# Altium schematic sheet FPGA SYSTERM.SchDoc
size A3
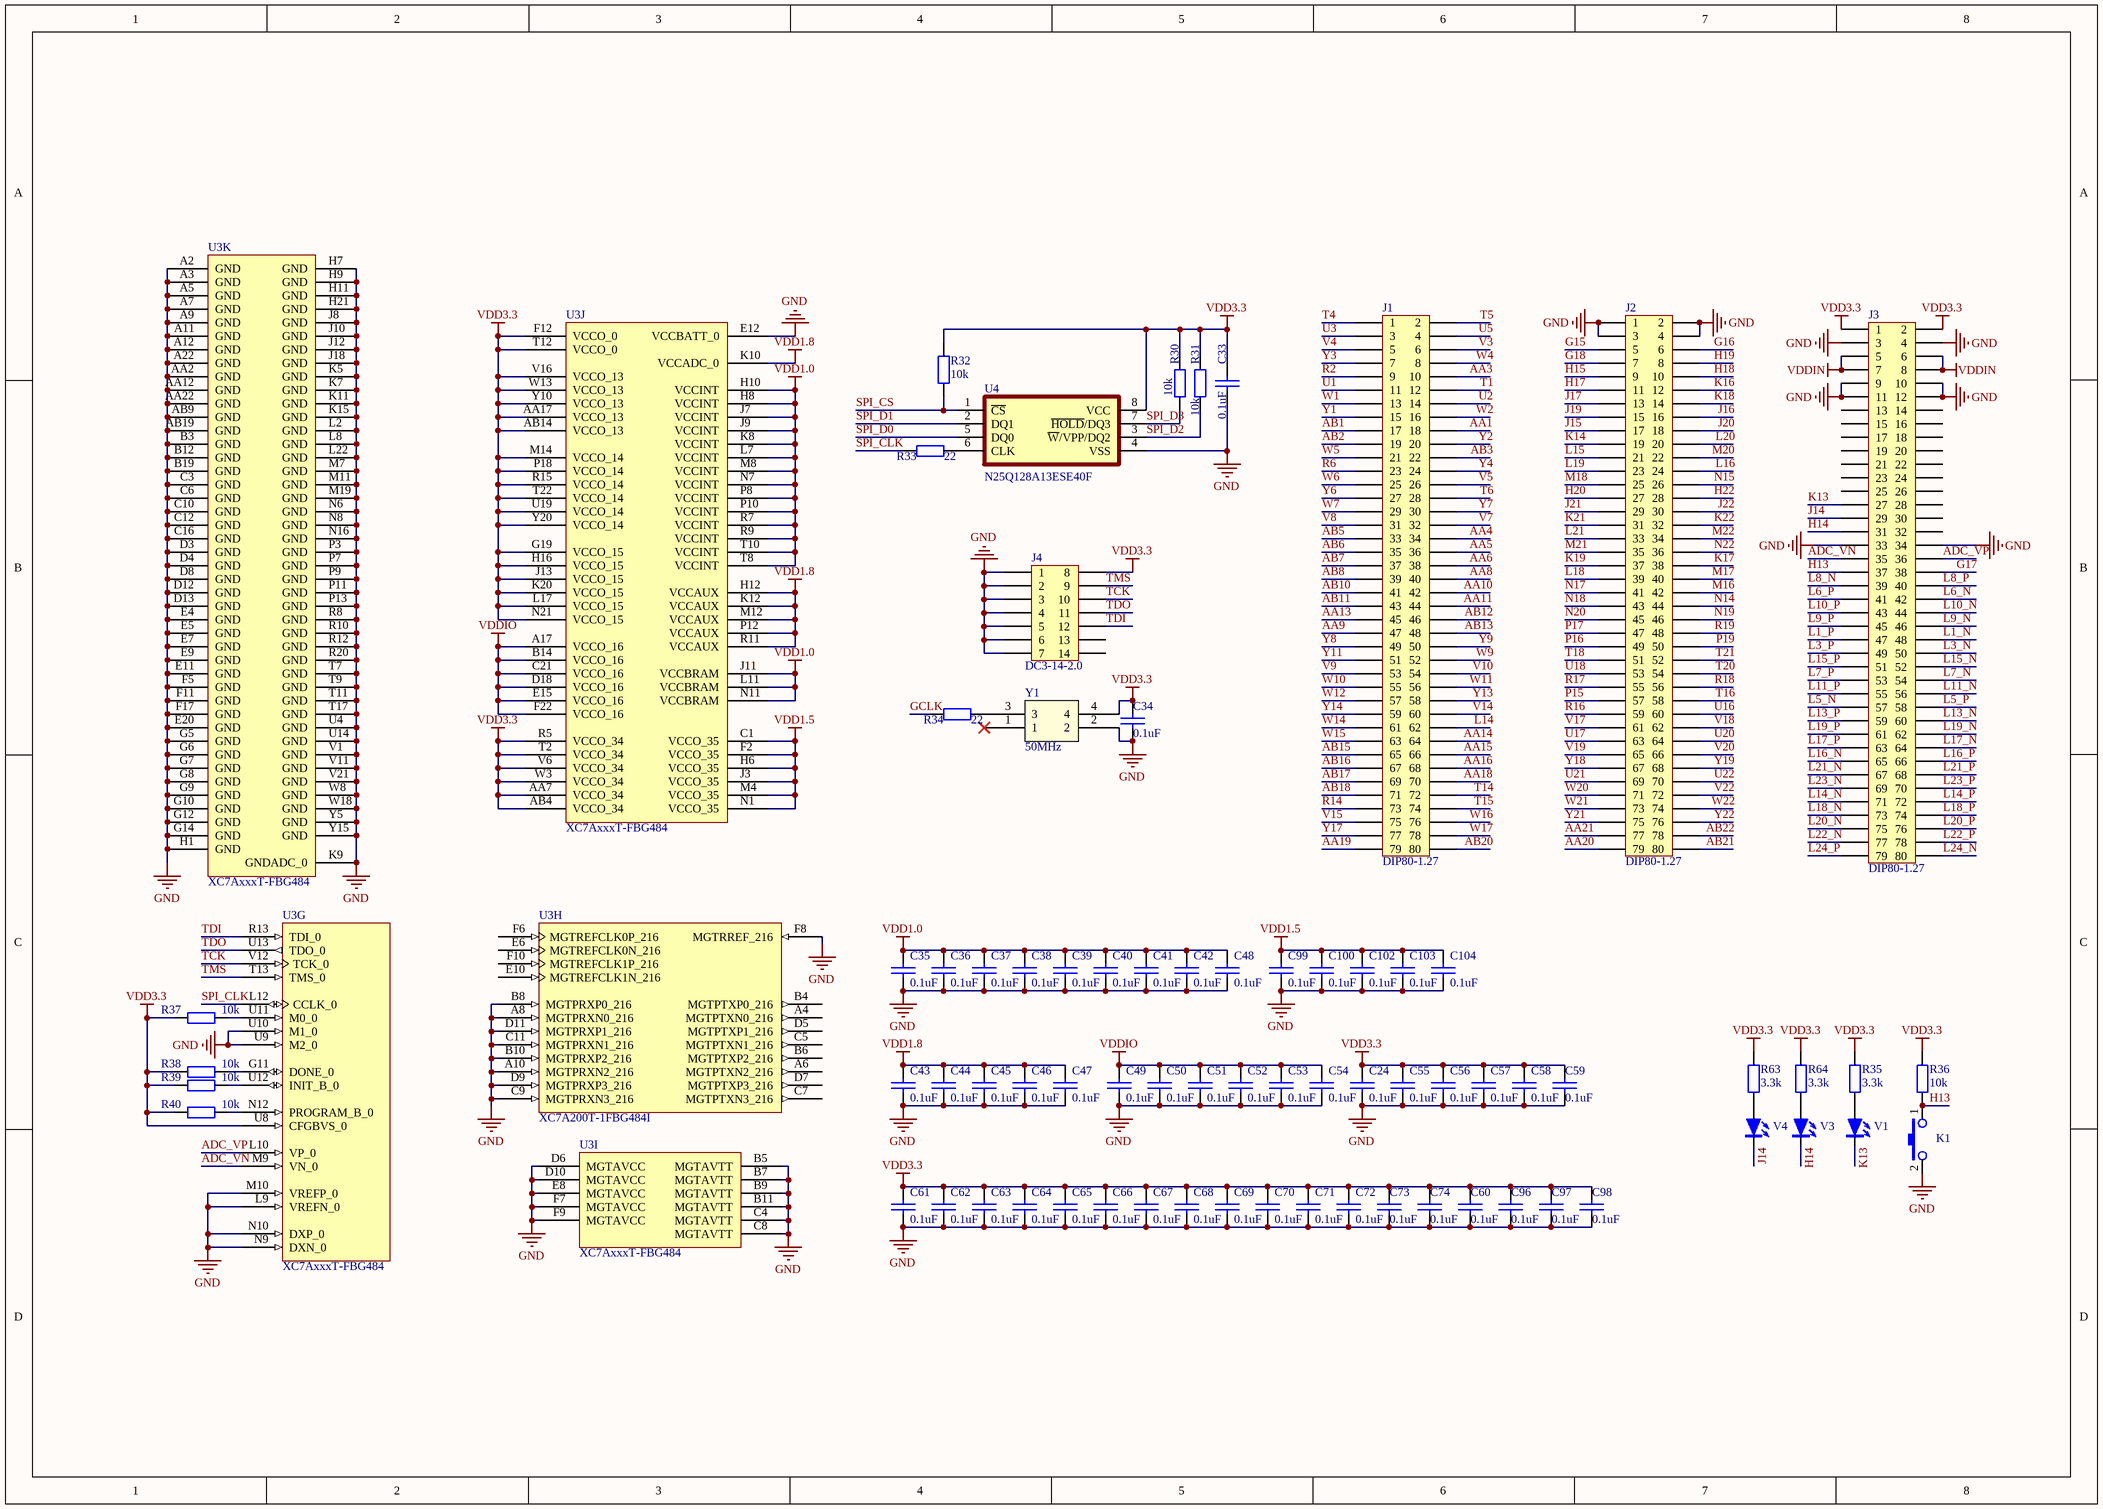
[diagram p0: FPGA SYSTERM.SchDoc]

## Parts
C24  0.1uF  [0402_c_m]
C33  0.1uF  [0402_C_M]
C34  0.1uF  [0402_C_M]
C35  0.1uF  [0402_C_M]
C36  0.1uF  [0402_C_M]
C37  0.1uF  [0402_C_M]
C38  0.1uF  [0402_C_M]
C39  0.1uF  [0402_C_M]
C40  0.1uF  [0402_C_M]
C41  0.1uF  [0402_C_M]
C42  0.1uF  [0402_C_M]
C43  0.1uF  [0402_C_M]
C44  0.1uF  [0402_C_M]
C45  0.1uF  [0402_C_M]
C46  0.1uF  [0402_C_M]
C47  0.1uF  [0402_C_M]
C48  0.1uF  [0402_C_M]
C49  0.1uF  [0402_C_M]
C50  0.1uF  [0402_C_M]
C51  0.1uF  [0402_C_M]
C52  0.1uF  [0402_C_M]
C53  0.1uF  [0402_C_M]
C54  0.1uF  [0402_C_M]
C55  0.1uF  [0402_C_M]
C56  0.1uF  [0402_C_M]
C57  0.1uF  [0402_C_M]
C58  0.1uF  [0402_C_M]
C59  0.1uF  [0402_C_M]
C60  0.1uF  [0402_C_M]
C61  0.1uF  [0402_C_M]
C62  0.1uF  [0402_C_M]
C63  0.1uF  [0402_C_M]
C64  0.1uF  [0402_C_M]
C65  0.1uF  [0402_C_M]
C66  0.1uF  [0402_C_M]
C67  0.1uF  [0402_C_M]
C68  0.1uF  [0402_C_M]
C69  0.1uF  [0402_C_M]
C70  0.1uF  [0402_C_M]
C71  0.1uF  [0402_C_M]
C72  0.1uF  [0402_C_M]
C73  0.1uF  [0402_C_M]
C74  0.1uF  [0402_C_M]
C96  0.1uF  [0402_C_M]
C97  0.1uF  [0402_C_M]
C98  0.1uF  [0402_C_M]
C99  0.1uF  [0402_C_M]
C100  0.1uF  [0402_C_M]
C102  0.1uF  [0402_C_M]
C103  0.1uF  [0402_C_M]
C104  0.1uF  [0402_C_M]
J1  DIP80-1.27  [DIP1.27-80]
J2  DIP80-1.27  [DIP1.27-80]
J3  DIP80-1.27  [DIP1.27-80]
J4  DC3-14-2.0  [DC3-14-2.0]
K1  KEY  [KEY2]  (value not drawn)
R30  10k  [0402_R_M]
R31  10k  [0402_R_M]
R32  10k  [0402_R_M]
R33  22  [0402_R_M]
R34  22  [0402_R_M]
R35  3.3k  [0402_R_M]
R36  10k  [0402_R_M]
R37  10k  [0402_R_M]
R38  10k  [0402_R_M]
R39  10k  [0402_R_M]
R40  10k  [0402_R_M]
R63  3.3k  [0402_R_M]
R64  3.3k  [0402_R_M]
U3  XC7AxxxT-FBG484  [FBG484]  (parts G,H,I,J,K of 11)
U4  N25Q128A13ESE40F  [SOP8W]
V1  LED  [0805D]  (value not drawn)
V3  LED  [0805D]  (value not drawn)
V4  LED  [0805D]  (value not drawn)
Y1  50MHz  [OSC 7050-4P]

## Nets
GND: C24.2 C33.2 C34.2 C35.2 C36.2 C37.2 C38.2 C39.2 C40.2 C41.2 C42.2 C43.2 C44.2 C45.2 C46.2 C47.2 C48.2 C49.2 C50.2 C51.2 C52.2 C53.2 C54.2 C55.2 C56.2 C57.2 C58.2 C59.2 C60.2 C61.2 C62.2 C63.2 C64.2 C65.2 C66.2 C67.2 C68.2 C69.2 C70.2 C71.2 C72.2 C73.2 C74.2 C96.2 C97.2 C98.2 C99.2 C100.2 C102.2 C103.2 C104.2 J2.1 J2.2 J2.3 J2.4 J3.3 J3.4 J3.9 J3.10 J3.11 J3.12 J3.33 J3.34 J4.1 J4.2 J4.3 J4.4 J4.5 J4.6 J4.7 K1.2 U3.A2(GND) U3.A3(GND) U3.A5(GND) U3.A7(GND) U3.A8(MGTPRXN0_216) U3.A9(GND) U3.A10(MGTPRXN2_216) U3.A11(GND) U3.A12(GND) U3.A22(GND) U3.AA2(GND) U3.AA12(GND) U3.AA22(GND) U3.AB9(GND) U3.AB19(GND) U3.B3(GND) U3.B5(MGTAVTT) U3.B7(MGTAVTT) U3.B8(MGTPRXP0_216) U3.B9(MGTAVTT) U3.B10(MGTPRXP2_216) U3.B11(MGTAVTT) U3.B12(GND) U3.B19(GND) U3.C3(GND) U3.C4(MGTAVTT) U3.C6(GND) U3.C8(MGTAVTT) U3.C9(MGTPRXN3_216) U3.C10(GND) U3.C11(MGTPRXN1_216) U3.C12(GND) U3.C16(GND) U3.D3(GND) U3.D4(GND) U3.D6(MGTAVCC) U3.D8(GND) U3.D9(MGTPRXP3_216) U3.D10(MGTAVCC) U3.D11(MGTPRXP1_216) U3.D12(GND) U3.D13(GND) U3.E4(GND) U3.E5(GND) U3.E7(GND) U3.E8(MGTAVCC) U3.E9(GND) U3.E11(GND) U3.E12(VCCBATT_0) U3.E20(GND) U3.F5(GND) U3.F7(MGTAVCC) U3.F8(MGTRREF_216) U3.F9(MGTAVCC) U3.F11(GND) U3.F17(GND) U3.G5(GND) U3.G6(GND) U3.G7(GND) U3.G8(GND) U3.G9(GND) U3.G10(GND) U3.G12(GND) U3.G14(GND) U3.H1(GND) U3.H7(GND) U3.H9(GND) U3.H11(GND) U3.H21(GND) U3.J8(GND) U3.J10(GND) U3.J12(GND) U3.J18(GND) U3.K5(GND) U3.K7(GND) U3.K9(GNDADC_0) U3.K11(GND) U3.K15(GND) U3.L2(GND) U3.L8(GND) U3.L9(VREFN_0) U3.L22(GND) U3.M7(GND) U3.M10(VREFP_0) U3.M11(GND) U3.M19(GND) U3.N6(GND) U3.N8(GND) U3.N9(DXN_0) U3.N10(DXP_0) U3.N16(GND) U3.P3(GND) U3.P7(GND) U3.P9(GND) U3.P11(GND) U3.P13(GND) U3.R8(GND) U3.R10(GND) U3.R12(GND) U3.R20(GND) U3.T7(GND) U3.T9(GND) U3.T11(GND) U3.T17(GND) U3.U4(GND) U3.U9(M2_0) U3.U10(M1_0) U3.U14(GND) U3.V1(GND) U3.V11(GND) U3.V21(GND) U3.W8(GND) U3.W18(GND) U3.Y5(GND) U3.Y15(GND) U4.4(VSS) Y1.2
VDD1.0: C35.1 C36.1 C37.1 C38.1 C39.1 C40.1 C41.1 C42.1 C48.1 U3.H8(VCCINT) U3.H10(VCCINT) U3.J7(VCCINT) U3.J9(VCCINT) U3.J11(VCCBRAM) U3.K8(VCCINT) U3.L7(VCCINT) U3.L11(VCCBRAM) U3.M8(VCCINT) U3.N7(VCCINT) U3.N11(VCCBRAM) U3.P8(VCCINT) U3.P10(VCCINT) U3.R7(VCCINT) U3.R9(VCCINT) U3.T8(VCCINT) U3.T10(VCCINT)
VDD1.5: C99.1 C100.1 C102.1 C103.1 C104.1 U3.C1(VCCO_35) U3.F2(VCCO_35) U3.H6(VCCO_35) U3.J3(VCCO_35) U3.M4(VCCO_35) U3.N1(VCCO_35)
VDD1.8: C43.1 C44.1 C45.1 C46.1 C47.1 U3.H12(VCCAUX) U3.K10(VCCADC_0) U3.K12(VCCAUX) U3.M12(VCCAUX) U3.P12(VCCAUX) U3.R11(VCCAUX)
VDD3.3: C24.1 C33.1 C34.1 C55.1 C56.1 C57.1 C58.1 C59.1 C60.1 C61.1 C62.1 C63.1 C64.1 C65.1 C66.1 C67.1 C68.1 C69.1 C70.1 C71.1 C72.1 C73.1 C74.1 C96.1 C97.1 C98.1 J3.1 J3.2 J4.8 R30.2 R31.2 R32.1 R35.2 R36.2 R37.2 R38.2 R39.2 R40.2 R63.2 R64.2 U3.AA7(VCCO_34) U3.AA17(VCCO_13) U3.AB4(VCCO_34) U3.AB14(VCCO_13) U3.F12(VCCO_0) U3.G19(VCCO_15) U3.H16(VCCO_15) U3.J13(VCCO_15) U3.K20(VCCO_15) U3.L17(VCCO_15) U3.M14(VCCO_14) U3.N21(VCCO_15) U3.P18(VCCO_14) U3.R5(VCCO_34) U3.R15(VCCO_14) U3.T2(VCCO_34) U3.T12(VCCO_0) U3.T22(VCCO_14) U3.U8(CFGBVS_0) U3.U19(VCCO_14) U3.V6(VCCO_34) U3.V16(VCCO_13) U3.W3(VCCO_34) U3.W13(VCCO_13) U3.Y10(VCCO_13) U3.Y20(VCCO_14) U4.8(VCC) Y1.4
VDDIN: J3.5 J3.6 J3.7 J3.8
VDDIO: C49.1 C50.1 C51.1 C52.1 C53.1 C54.1 U3.A17(VCCO_16) U3.B14(VCCO_16) U3.C21(VCCO_16) U3.D18(VCCO_16) U3.E15(VCCO_16) U3.F22(VCCO_16)
AA1: J1.18
AA3: J1.10
AA4: J1.34
AA5: J1.36
AA6: J1.38
AA8: J1.40
AA9: J1.47
AA10: J1.42
AA11: J1.44
AA13: J1.45
AA14: J1.64
AA15: J1.66
AA16: J1.68
AA18: J1.70
AA19: J1.79
AA20: J2.79
AA21: J2.77
AB1: J1.17
AB2: J1.19
AB3: J1.22
AB5: J1.33
AB6: J1.35
AB7: J1.37
AB8: J1.39
AB10: J1.41
AB11: J1.43
AB12: J1.46
AB13: J1.48
AB15: J1.65
AB16: J1.67
AB17: J1.69
AB18: J1.71
AB20: J1.80
AB21: J2.80
AB22: J2.78
ADC_VN: J3.35 U3.M9(VN_0)
ADC_VP: J3.36 U3.L10(VP_0)
G15: J2.5
G16: J2.6
G17: J3.38
G18: J2.7
GCLK: R34.2
H13: J3.37 K1.1 R36.1
H14: J3.31 V3.2
H15: J2.9
H17: J2.11
H18: J2.10
H19: J2.8
H20: J2.27
H22: J2.28
J14: J3.29 V4.2
J15: J2.17
J16: J2.16
J17: J2.13
J19: J2.15
J20: J2.18
J21: J2.29
J22: J2.30
K13: J3.27 V1.2
K14: J2.19
K16: J2.12
K17: J2.38
K18: J2.14
K19: J2.37
K21: J2.31
K22: J2.32
L1_N: J3.48
L1_P: J3.47
L3_N: J3.50
L3_P: J3.49
L5_N: J3.57
L5_P: J3.58
L6_N: J3.42
L6_P: J3.41
L7_N: J3.54
L7_P: J3.53
L8_N: J3.39
L8_P: J3.40
L9_N: J3.46
L9_P: J3.45
L10_N: J3.44
L10_P: J3.43
L11_N: J3.56
L11_P: J3.55
L13_N: J3.60
L13_P: J3.59
L14: J1.62
L14_N: J3.71
L14_P: J3.72
L15: J2.21
L15_N: J3.52
L15_P: J3.51
L16: J2.24
L16_N: J3.65
L16_P: J3.66
L17_N: J3.64
L17_P: J3.63
L18: J2.39
L18_N: J3.73
L18_P: J3.74
L19: J2.23
L19_N: J3.62
L19_P: J3.61
L20: J2.20
L20_N: J3.75
L20_P: J3.76
L21: J2.33
L21_N: J3.67
L21_P: J3.68
L22_N: J3.77
L22_P: J3.78
L23_N: J3.69
L23_P: J3.70
L24_N: J3.80
L24_P: J3.79
M16: J2.42
M17: J2.40
M18: J2.25
M20: J2.22
M21: J2.35
M22: J2.34
N14: J2.44
N15: J2.26
N17: J2.41
N18: J2.43
N19: J2.46
N20: J2.45
N22: J2.36
P15: J2.57
P16: J2.49
P17: J2.47
P19: J2.50
R2: J1.9
R6: J1.23
R14: J1.73
R16: J2.59
R17: J2.55
R18: J2.56
R19: J2.48
SPI_CLK: R33.2 U3.L12(CCLK_0)
SPI_CS: R32.2 U4.1(~{CS})
SPI_D0: U4.5(DQ0)
SPI_D1: U4.2(DQ1)
SPI_D2: R31.1 U4.3(~{W}/VPP/DQ2)
SPI_D3: R30.1 U4.7(~{HOLD}/DQ3)
T1: J1.12
T4: J1.1
T5: J1.2
T6: J1.28
T14: J1.72
T15: J1.74
T16: J2.58
T18: J2.51
T20: J2.54
T21: J2.52
TCK: J4.10 U3.V12(TCK_0)
TDI: J4.12 U3.R13(TDI_0)
TDO: J4.11 U3.U13(TDO_0)
TMS: J4.9 U3.T13(TMS_0)
U1: J1.11
U2: J1.14
U3: J1.3
U5: J1.4
U16: J2.60
U17: J2.63
U18: J2.53
U20: J2.64
U21: J2.69
U22: J2.70
V3: J1.6
V4: J1.5
V5: J1.26
V7: J1.32
V8: J1.31
V9: J1.53
V10: J1.54
V14: J1.60
V15: J1.75
V17: J2.61
V18: J2.62
V19: J2.65
V20: J2.66
V22: J2.72
W1: J1.13
W2: J1.16
W4: J1.8
W5: J1.21
W6: J1.25
W7: J1.29
W9: J1.52
W10: J1.55
W11: J1.56
W12: J1.57
W14: J1.61
W15: J1.63
W16: J1.76
W17: J1.78
W20: J2.71
W21: J2.73
W22: J2.74
Y1: J1.15
Y2: J1.20
Y3: J1.7
Y4: J1.24
Y6: J1.27
Y7: J1.30
Y8: J1.49
Y9: J1.50
Y11: J1.51
Y13: J1.58
Y14: J1.59
Y17: J1.77
Y18: J2.67
Y19: J2.68
Y21: J2.75
Y22: J2.76
NetR33_1: R33.1 U4.6(CLK)
NetR34_1: R34.1 Y1.3
NetR35_1: R35.1 V1.1
NetR37_1: R37.1 U3.U11(M0_0)
NetR38_1: R38.1 U3.G11(DONE_0)
NetR39_1: R39.1 U3.U12(INIT_B_0)
NetR40_1: R40.1 U3.N12(PROGRAM_B_0)
NetR63_1: R63.1 V4.1
NetR64_1: R64.1 V3.1

Not connected (* = marked no-connect by the designer): J3 13 14 15 16 17 18 19 20 21 22 23 24 25 26 28 30 32; J4 13 14; U3 A4(MGTPTXN0_216) A6(MGTPTXN2_216) B4(MGTPTXP0_216) B6(MGTPTXP2_216) C5(MGTPTXN1_216) C7(MGTPTXN3_216) D5(MGTPTXP1_216) D7(MGTPTXP3_216) E6(MGTREFCLK0N_216) E10(MGTREFCLK1N_216) F6(MGTREFCLK0P_216) F10(MGTREFCLK1P_216); Y1 1*

## Library data of the parts
C24 C33-C74 C96-C100 C102-C104 = CAP
J1-J3 = CON80_1
J4 = CON14
K1 = KEY1
R30-R40 R63 R64 = RES2
U3 = XC7A200T-1FBG484I: Artix-7 FPGA, 285 User I/Os, 4 GTP, 484-Ball BGA, Speed Grade 1, Industrial Grade, Pb-Free; Manufacturer: Xilinx; Block RAM Blocks (18Kb): 730; Block RAM Blocks (36Kb): 365; Block RAM Blocks (Max Kb): 13140; CLBs (Slices): 33650; Clock Mgmt Tiles (CMTs): 10; DSP48E1 Slices: 740; Logic Cells: 215360; Max User I/O: 500; Speed Grade: -1; DatasheetVersion: v1.12; PackageVersion: Rev 1.8; PackageReference: FBG484; PackageDescription: Flip-Chip Lidless BGA, Body 23 x 23 mm, 1.0 mm Pitch; CLBs (Max Distributed RAM Kb): 2888; Generic Part Number: XC7A200T; RoHS: Pb-Free; Mounting Technology: Surface Mount; Code_JEDEC: MS-034; PartNumber: XC7A200T-1FBG484I; ComponentLink1Description: Datasheet; ComponentLink1URL: http://www.xilinx.com/support/documentation/data_sheets/ds180_7Series_Overview.pdf; ComponentLink2Description: Package Specification; ComponentLink2URL: http://www.xilinx.com/support/documentation/user_guides/ug475_7Series_Pkg_Pinout.pdf; ComponentLink3Description: DC and Switching Characteristics; ComponentLink3URL: http://www.xilinx.com/support/documentation/data_sheets/ds181_Artix_7_Data_Sheet.pdf; ComponentLink4Description: Package File; ComponentLink4URL: http://www.xilinx.com/support/packagefiles/a7packages/xc7a200tfbg484pkg.txt; ComponentLink5Description: Packaging and Pinout; ComponentLink5URL: http://www.xilinx.com/support/documentation/user_guides/ug475_7Series_Pkg_Pinout.pdf
U4 = N25Q128A11EF840E
V1 V3 V4 = LED2
Y1 = XTAL